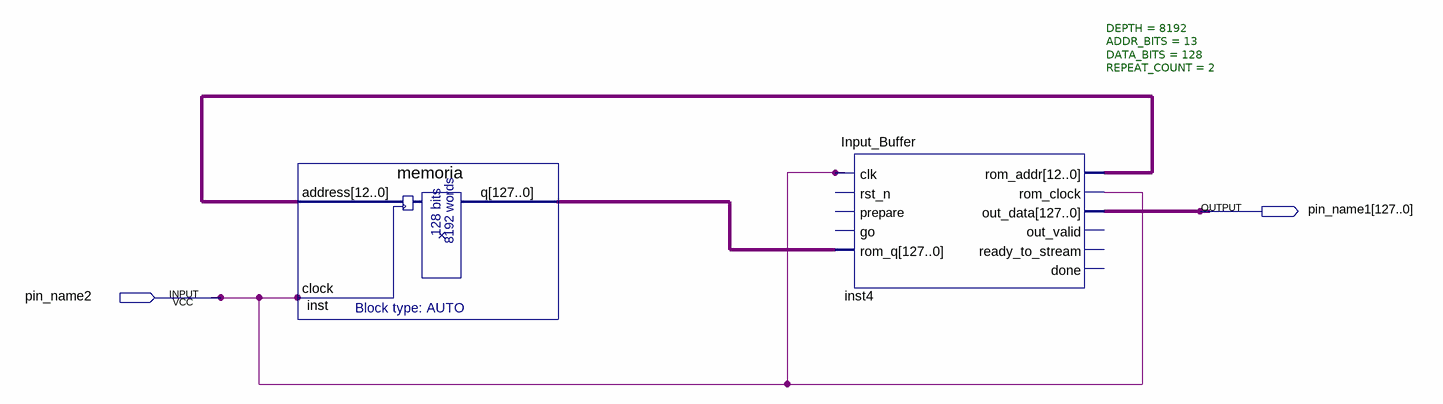
[diagram p0: schematic sheet]
// Quartus schematic TOP.bdf as structural Verilog: 2 symbols, 2 pins
module TOP (
  input  pin_name2,
  output [127:0] pin_name1
);

  wire [12:0] inst4_rom_addr;
  wire [127:0] inst_q;

  memoria inst (.address(inst4_rom_addr), .clock(pin_name2), .q(inst_q));
  Input_Buffer #(.DEPTH(8192), .ADDR_BITS(13), .DATA_BITS(128), .REPEAT_COUNT(2)) inst4 (
    .clk(pin_name2), .rom_q(inst_q), .rom_addr(inst4_rom_addr), .rom_clock(pin_name2), .out_data(pin_name1));  // open: rst_n, prepare, go, out_valid, ready_to_stream, done
endmodule
